# Altium schematic sheet USB.SchDoc
size A4; SheetNumber: 10; SheetTotal: 17
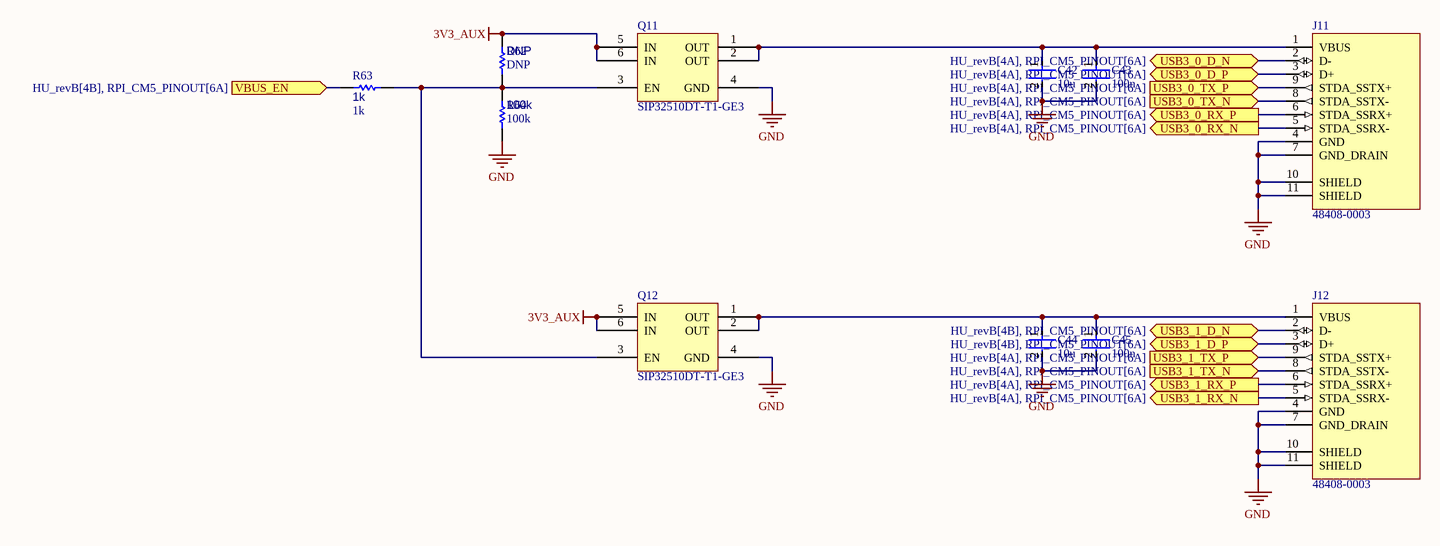
[diagram p0: USB.SchDoc]

## Parts
C42  10u  [FP-0402-L_1_0_0_05-W_0_5-IPC_A]
C43  100n  [FP-0402-L_1_0_0_05-W_0_5-IPC_A]
C44  10u  [FP-0402-L_1_0_0_05-W_0_5-IPC_A]
C45  100n  [FP-0402-L_1_0_0_05-W_0_5-IPC_A]
J11  48408-0003  [MOLX-48408-0003_V]
J12  48408-0003  [MOLX-48408-0003_V]
Q11  SIP32510DT-T1-GE3  [SOT95P284X110-6N]
Q12  SIP32510DT-T1-GE3  [SOT95P284X110-6N]
R62  DNP  [R0603B]
R63  1k  [R0603B]
R64  100k  [R0603B]

## Ports
USB3_0_D_N (bidir, see HU_revB[4A], RPI_CM5_PINOUT[6A]), USB3_0_D_P (bidir, see HU_revB[4A], RPI_CM5_PINOUT[6A]), USB3_0_RX_N (out, see HU_revB[4A], RPI_CM5_PINOUT[6A]), USB3_0_RX_P (out, see HU_revB[4A], RPI_CM5_PINOUT[6A]), USB3_0_TX_N (in, see HU_revB[4A], RPI_CM5_PINOUT[6A]), USB3_0_TX_P (in, see HU_revB[4A], RPI_CM5_PINOUT[6A]), USB3_1_D_N (bidir, see HU_revB[4B], RPI_CM5_PINOUT[6A]), USB3_1_D_P (bidir, see HU_revB[4B], RPI_CM5_PINOUT[6A]), USB3_1_RX_N (out, see HU_revB[4A], RPI_CM5_PINOUT[6A]), USB3_1_RX_P (out, see HU_revB[4A], RPI_CM5_PINOUT[6A]), USB3_1_TX_N (in, see HU_revB[4A], RPI_CM5_PINOUT[6A]), USB3_1_TX_P (in, see HU_revB[4A], RPI_CM5_PINOUT[6A]), VBUS_EN (in, see HU_revB[4B], RPI_CM5_PINOUT[6A])

## Nets
3V3_AUX: Q11.5(IN) Q11.6(IN) Q12.5(IN) Q12.6(IN) R62.2
GND: C42.2 C43.2 C44.2 C45.2 J11.4(GND) J11.7(GND_DRAIN) J11.10(SHIELD) J11.11(SHIELD) J12.4(GND) J12.7(GND_DRAIN) J12.10(SHIELD) J12.11(SHIELD) Q11.4(GND) Q12.4(GND) R64.1
USB3_0_D_N: J11.2(D-) ; port USB3_0_D_N
USB3_0_D_P: J11.3(D+) ; port USB3_0_D_P
USB3_0_RX_N: J11.5(STDA_SSRX-) ; port USB3_0_RX_N
USB3_0_RX_P: J11.6(STDA_SSRX+) ; port USB3_0_RX_P
USB3_0_TX_N: J11.8(STDA_SSTX-) ; port USB3_0_TX_N
USB3_0_TX_P: J11.9(STDA_SSTX+) ; port USB3_0_TX_P
USB3_1_D_N: J12.2(D-) ; port USB3_1_D_N
USB3_1_D_P: J12.3(D+) ; port USB3_1_D_P
USB3_1_RX_N: J12.5(STDA_SSRX-) ; port USB3_1_RX_N
USB3_1_RX_P: J12.6(STDA_SSRX+) ; port USB3_1_RX_P
USB3_1_TX_N: J12.8(STDA_SSTX-) ; port USB3_1_TX_N
USB3_1_TX_P: J12.9(STDA_SSTX+) ; port USB3_1_TX_P
VBUS_EN: R63.2 ; port VBUS_EN
NetC42_1: C42.1 C43.1 J11.1(VBUS) Q11.1(OUT) Q11.2(OUT)
NetC44_1: C44.1 C45.1 J12.1(VBUS) Q12.1(OUT) Q12.2(OUT)
NetQ11_3: Q11.3(EN) Q12.3(EN) R62.1 R63.1 R64.2

## Library data of the parts
C42-C45 = CMP-001-00058-1: LARGE PADS, 0402 CAP, CHANGE COMMENT TO MATCH REAL P/N; Capacitor Type: Ceramic; Min Operating Temperature: -55°C; Mounting Technology: Surface Mount; Pins: 2; Case/Package: 0402; RoHS Compliant: Yes; Max Operating Temperature: 85°C
J11 J12 = CMP-0411-00003-1: Universal Serial Bus (USB 3.0) I/O Connector, Vertical, Type A, Through Hole, 9 Circuits, -20 to 85 degC, RoHS, Tray; No. of Positions: 9; No. of Rows: 2; Packing: Tray; Orientation: Vertical; ComponentLink3Description: Package Specification; ComponentLink2URL: http://www.molex.com/webdocs/datasheets/pdf/en-us/0484080003_IO_CONNECTORS.pdf; ComponentLink3URL: http://www.molex.com/pdm_docs/sd/484080003_sd.pdf; ComponentLink1Description: Manufacturer URL; PackageVersion: Rev. F, 12/2012; Mounting Technology: Through Hole; Temperature Min: -20 degC; ComponentLink2Description: Datasheet; PackageDescription: 9-Pin USB 3.0 I/O Receptacle, Vertical, Height 15.25 mm, Through Hole; PartNumber: 48408-0003; Temperature Max: 85 degC; RoHS: TRUE; ComponentLink1URL: http://www.molex.com/
Q11 Q12 = CMP-019-00054-1: Power Switch ICs – Power Distribution; VISHAY; SIP32510DT-T1-GE3; 1; 1; 5.5 V; SOT-23-6; Max Supply Voltage: 5.5V; Max Power Dissipation: 833mW; Min Supply Voltage: 1.2V; Case/Package: SOT-23-6; Mounting Technology: Surface Mount; Max Operating Temperature: 85°C; Min Operating Temperature: -40°C
R62-R64 = CMP-009-00002-14: Resistor
  R62: Value: DNP
  R63: Value: 1k
  R64: Value: 100k